# EAGLE design Sensor01-1 (EAGLE 7.6.0)
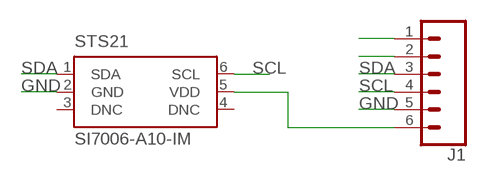
[diagram p0: schematic, sheet 1]

## Parts
J1  CONN_06LONGPADS  [1X06_LONGPADS]
STS21  SI7006-A10-IM  [DFN6-3X3]

## Nets
GND: J1.5 STS21.2(GND)
N$1: J1.1
N$2: J1.2
N$3: J1.6 STS21.5(VDD)
SCL: J1.4 STS21.6(SCL)
SDA: J1.3 STS21.1(SDA)
Unconnected: STS21.3(DNC) STS21.4(DNC)

## Library data of the parts
J1 = SparkFun-Connectors:CONN_06: Multi connection point. Often used as Generic Header-pin footprint for 0.1 inch spaced/style header connections On any of the 0.1 inch spaced packages, you can populate with these: Break Away Headers - Straight <https://www.sparkfun.com/products/116> (PRT-00116) Break Away Male Headers - Right Angle <https://www.sparkfun.com/products/553> (PRT-00553) Female Headers <https://www.sparkfun.com/products/115> (PRT-00115) Break Away Headers - Machine Pin <https://www.sparkfun.com/products/117> (PRT-00117) Break Away Female Headers - Swiss Machine Pin <https://www.sparkfun.com/products/743> (PRT-00743) Arduino Stackable Header - 6 Pin <https://www.sparkfun.com/products/9280> (PRT-09280) For SCREWTERMINALS and SPRING TERMINALS visit here: Screw Terimnals on SparkFun.com <https://www.sparkfun.com/search/results?term=Screw+Terminals> (5mm/3.5mm/2.54mm spacing) This device is also useful as a general connection point to wire up your design to another part of your project. Our various solder wires solder well into these plated through hole pads. Hook-Up Wire - Assortment (Stranded, 22 AWG) <https://www.sparkfun.com/products/11375> (PRT-11375) Hook-Up Wire - Assortment (Solid Core, 22 AWG) <https://www.sparkfun.com/products/11367> (PRT-11367) View the entire wire category on our website here <https://www.sparkfun.com/categories/141>
STS21 = si70xx-10:SI7006-*: I2C Humidity and Temperature Sensor Source: http://www.silabs.com/Support%20Documents/TechnicalDocs/Si7006-A10.pdf; MF: Silicon Labs; MPN: Si7006-A10-IM; OC_FARNELL: unknown; OC_NEWARK: unknown

## Board
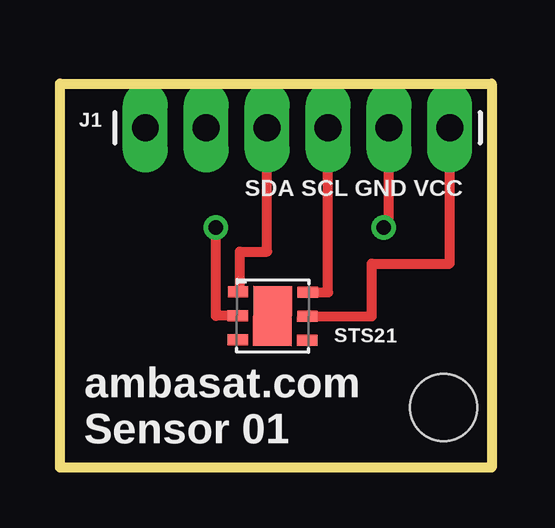
[diagram p1: board, top side]
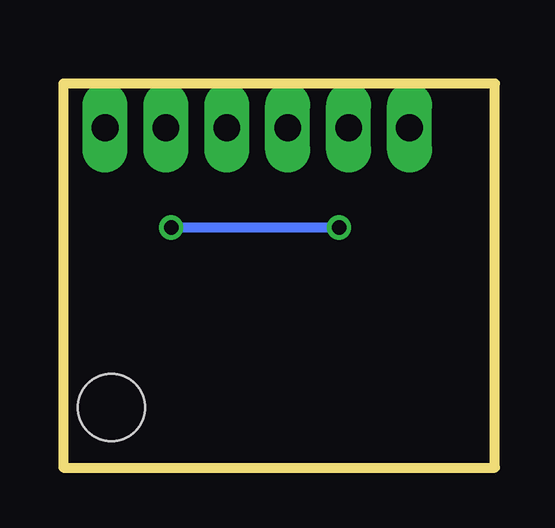
[diagram p2: board, bottom side, seen from below]

Size 18 x 16 mm. Coordinates in mm from the lower left corner, seen from the top.
Outline: 0,0 0,16 18,16 18,0 0,0
Copper layers (1*16): Top 0.035mm / dielectric 1.5mm / Bottom 0.035mm
Design rules "default": minimum track width 10mil, minimum drill 24mil, track to track 8mil, track to pad 8mil, pad to pad 8mil, via to via 8mil, smd to smd 8mil, copper to edge 40mil, drill to drill 8mil, minimum pad ring 10mil, minimum via ring 8mil, stop-mask expansion 4mil, vias tented up to drill 0mil, thermal gap 10mil
Holes 2.8 mm at 16,2.5

### Footprints (pad centres in the part's own frame; a part is rotated, then mirrored left to right if it is on the bottom)
1X06_LONGPADS = drill 1.118 pad 1.88 long: 1 0,0; 2 2.54,0; 3 5.08,0; 4 7.62,0; 5 10.16,0; 6 12.7,0
DFN6-3X3 = smd 0.85 x 0.45: 1 -1.45,1; 2 -1.45,0; 3 -1.45,-1; 4 1.45,-1; 5 1.45,0; 6 1.45,1 | smd 1.6 x 2.5: EXP 0,0

### Placement (x,y rotation side)
J1  3.56,14.16 0 top
STS21  8.87,6.31 359.6 top

### Tracks (layer width: path | path; a pad name or v marks a point on that pad's centre or on a via)
GND  (via drill 0.6)
  Top 0.406: STS21.2 6.5,6.32 v6.5,10 | v13.5,10 13.72,10 J1.5
  Bottom 0.406: v6.5,10 v13.5,10
N$3
  Top 0.406: STS21.5 13,6.3 13,8.5 16.26,8.5 J1.6
SCL
  Top 0.406: J1.4 11.18,7.3 STS21.6
SDA
  Top 0.406: STS21.1 7.5,7.32 7.5,9 8.64,9 J1.3

### Text on the board
tPlace: SDA SCL GND VCC | ambasat.com / Sensor 01